# EAGLE schematic chaves (EAGLE 7.2.0)
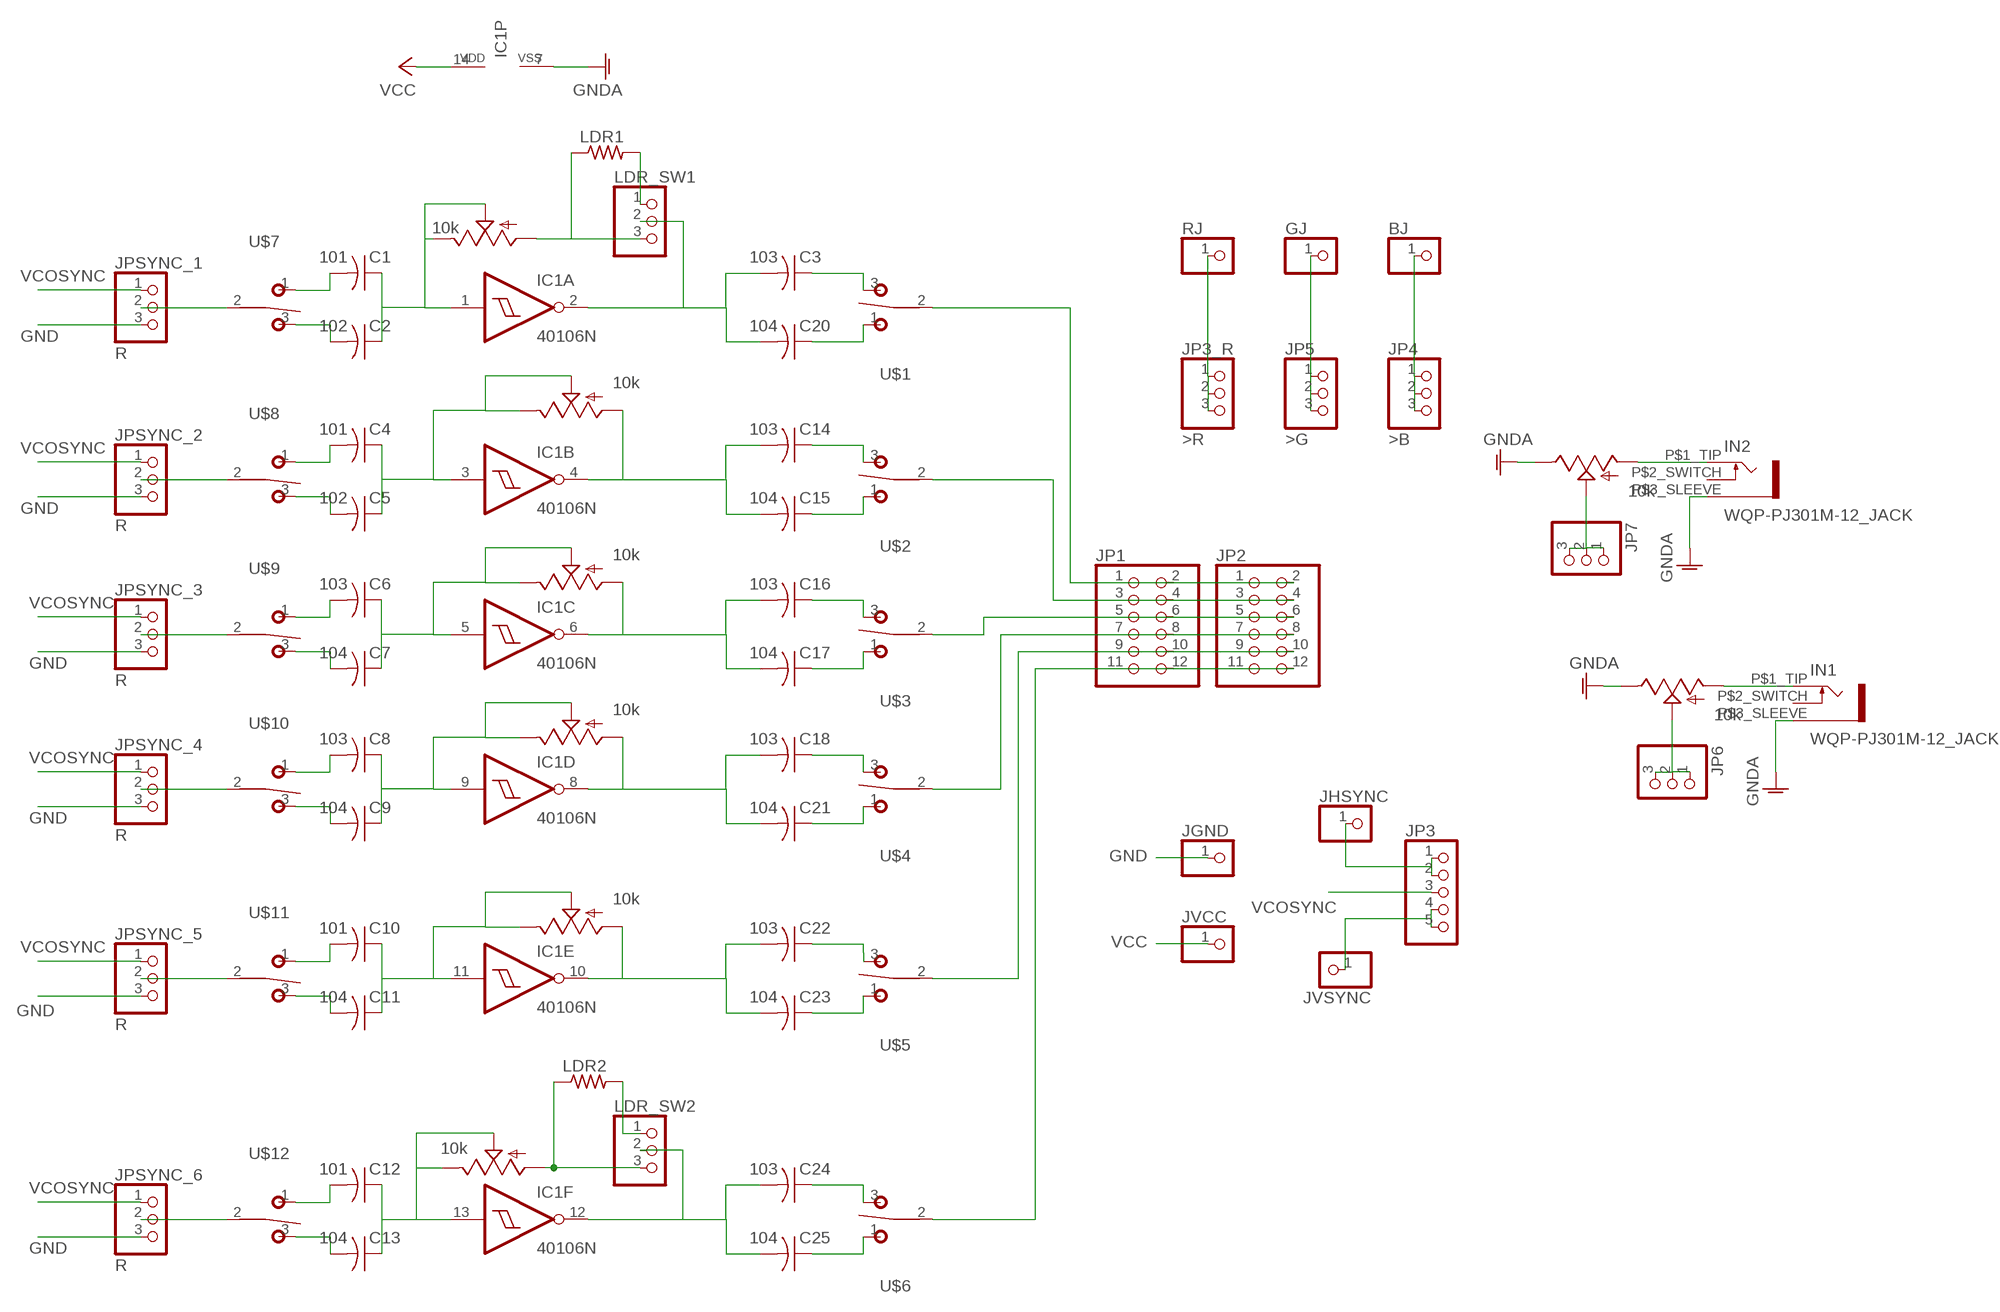
[diagram p0: schematic, sheet 1]

## Parts
BJ  PINHD-1X1  [1X01]
C1  101  C-US050-025X075  [C050-025X075]
C2  102  C-US050-025X075  [C050-025X075]
C3  103  C-US050-025X075  [C050-025X075]
C4  101  C-US050-025X075  [C050-025X075]
C5  102  C-US050-025X075  [C050-025X075]
C6  103  C-US050-025X075  [C050-025X075]
C7  104  C-US050-025X075  [C050-025X075]
C8  103  C-US050-025X075  [C050-025X075]
C9  104  C-US050-025X075  [C050-025X075]
C10  101  C-US050-025X075  [C050-025X075]
C11  104  C-US050-025X075  [C050-025X075]
C12  101  C-US050-025X075  [C050-025X075]
C13  104  C-US050-025X075  [C050-025X075]
C14  103  C-US050-025X075  [C050-025X075]
C15  104  C-US050-025X075  [C050-025X075]
C16  103  C-US050-025X075  [C050-025X075]
C17  104  C-US050-025X075  [C050-025X075]
C18  103  C-US050-025X075  [C050-025X075]
C20  104  C-US050-025X075  [C050-025X075]
C21  104  C-US050-025X075  [C050-025X075]
C22  103  C-US050-025X075  [C050-025X075]
C23  104  C-US050-025X075  [C050-025X075]
C24  103  C-US050-025X075  [C050-025X075]
C25  104  C-US050-025X075  [C050-025X075]
GJ  PINHD-1X1  [1X01]
IC1  40106N  [DIL14]
IN1  WQP-PJ301M-12_JACK  [WQP-PJ301M-12_JACK]
IN2  WQP-PJ301M-12_JACK  [WQP-PJ301M-12_JACK]
JGND  PINHD-1X1  [1X01]
JHSYNC  PINHD-1X1  [1X01]
JP1  PINHD-2X6  [2X06]
JP2  PINHD-2X6  [2X06]
JP3  PINHD-1X5  [1X05]
JP3_R  >R  PINHD-1X3  [1X03]
JP4  >B  PINHD-1X3  [1X03]
JP5  >G  PINHD-1X3  [1X03]
JP6  PINHD-1X3CB  [1X03-CLEANBIG]
JP7  PINHD-1X3CB  [1X03-CLEANBIG]
JPSYNC_1  R  PINHD-1X3  [1X03]
JPSYNC_2  R  PINHD-1X3  [1X03]
JPSYNC_3  R  PINHD-1X3  [1X03]
JPSYNC_4  R  PINHD-1X3  [1X03]
JPSYNC_5  R  PINHD-1X3  [1X03]
JPSYNC_6  R  PINHD-1X3  [1X03]
JVCC  PINHD-1X1  [1X01]
JVSYNC  PINHD-1X1  [1X01]
LDR1  R-US_0204/7  [0204/7]
LDR2  R-US_0204/7  [0204/7]
LDR_SW1  PINHD-1X3  [1X03]
LDR_SW2  PINHD-1X3  [1X03]
POT1  10k  POT_USVERTICAL  [ALPS_POT_VERTICAL]
POT2  10k  POT_USVERTICAL  [ALPS_POT_VERTICAL]
POT3  10k  POT_USVERTICAL  [ALPS_POT_VERTICAL]
POT4  10k  POT_USVERTICAL  [ALPS_POT_VERTICAL]
POT5  10k  POT_USVERTICAL  [ALPS_POT_VERTICAL]
POT6  10k  POT_USVERTICAL  [ALPS_POT_VERTICAL]
POT7  10k  POT_USVERTICAL  [ALPS_POT_VERTICAL]
POT8  10k  POT_USVERTICAL  [ALPS_POT_VERTICAL]
RJ  PINHD-1X1  [1X01]
U$1  T-80-T-SPDT-ON-OFF-ON  [M9040P]
U$2  T-80-T-SPDT-ON-OFF-ON  [M9040P]
U$3  T-80-T-SPDT-ON-OFF-ON  [M9040P]
U$4  T-80-T-SPDT-ON-OFF-ON  [M9040P]
U$5  T-80-T-SPDT-ON-OFF-ON  [M9040P]
U$6  T-80-T-SPDT-ON-OFF-ON  [M9040P]
U$7  T-80-T-SPDT-ON-OFF-ON  [M9040P]
U$8  T-80-T-SPDT-ON-OFF-ON  [M9040P]
U$9  T-80-T-SPDT-ON-OFF-ON  [M9040P]
U$10  T-80-T-SPDT-ON-OFF-ON  [M9040P]
U$11  T-80-T-SPDT-ON-OFF-ON  [M9040P]
U$12  T-80-T-SPDT-ON-OFF-ON  [M9040P]

## Nets
GND: IC1.7(P:VSS) IN1.P$3_SLEEVE IN2.P$3_SLEEVE JGND.1 JPSYNC_1.3 JPSYNC_2.3 JPSYNC_3.3 JPSYNC_4.3 JPSYNC_5.3 JPSYNC_6.3 POT7.P$1(E) POT8.P$1(E) ; supply symbol labelled GNDA
GND1: C3.2 C20.2 IC1.2(A:O) LDR_SW1.2
GND2: C14.2 C15.2 IC1.4(B:O) POT2.P$3(A)
GND3: C16.2 C17.2 IC1.6(C:O) POT3.P$3(A)
GND4: C18.2 C21.2 IC1.8(D:O) POT4.P$3(A)
GND5: C22.2 C23.2 IC1.10(E:O) POT5.P$3(A)
GND6: C24.2 C25.2 IC1.12(F:O) LDR_SW2.2
N$1: C1.2 U$7.1(O)
N$2: C2.2 U$7.3(S)
N$3: LDR2.2 LDR_SW2.1
N$4: C5.2 U$8.3(S)
N$5: C4.2 U$8.1(O)
N$6: LDR1.2 LDR_SW1.1
N$7: C8.2 U$10.1(O)
N$8: C9.2 U$10.3(S)
N$9: IN2.P$1_TIP POT8.P$3(A)
N$10: C6.2 U$9.1(O)
N$11: C7.2 U$9.3(S)
N$12: JP6.1 JP6.2 JP6.3 POT7.P$2(S)
N$13: BJ.1 JP4.1 JP4.2 JP4.3
N$14: GJ.1 JP5.1 JP5.2 JP5.3
N$15: JP3_R.1 JP3_R.2 JP3_R.3 RJ.1
N$16: C20.1 U$1.1(O)
N$17: C3.1 U$1.3(S)
N$18: JP1.1 JP1.2 JP2.1 JP2.2 U$1.2(P)
N$19: LDR1.1 LDR_SW1.3 POT1.P$3(A)
N$20: JHSYNC.1 JP3.1 JP3.2
N$21: JP3.4 JP3.5 JVSYNC.1
N$22: LDR2.1 LDR_SW2.3 POT6.P$3(A)
N$23: IN1.P$1_TIP POT7.P$3(A)
N$24: C15.1 U$2.1(O)
N$25: JP7.1 JP7.2 JP7.3 POT8.P$2(S)
N$26: C14.1 U$2.3(S)
N$27: JP1.3 JP1.4 JP2.3 JP2.4 U$2.2(P)
N$28: C17.1 U$3.1(O)
N$29: C16.1 U$3.3(S)
N$30: JP1.5 JP1.6 JP2.5 JP2.6 U$3.2(P)
N$31: C1.1 C2.1 IC1.1(A:I) POT1.P$1(E) POT1.P$2(S)
N$32: C4.1 C5.1 IC1.3(B:I) POT2.P$1(E) POT2.P$2(S)
N$33: C6.1 C7.1 IC1.5(C:I) POT3.P$1(E) POT3.P$2(S)
N$34: C8.1 C9.1 IC1.9(D:I) POT4.P$1(E) POT4.P$2(S)
N$37: C21.1 U$4.1(O)
N$38: C18.1 U$4.3(S)
N$39: JP1.7 JP1.8 JP2.7 JP2.8 U$4.2(P)
N$40: C23.1 U$5.1(O)
N$41: C22.1 U$5.3(S)
N$42: JP1.9 JP1.10 JP2.9 JP2.10 U$5.2(P)
N$43: C25.1 U$6.1(O)
N$44: C24.1 U$6.3(S)
N$45: JP1.11 JP1.12 JP2.11 JP2.12 U$6.2(P)
N$46: C10.2 U$11.1(O)
N$47: C10.1 C11.1 IC1.11(E:I) POT5.P$1(E) POT5.P$2(S)
N$48: C11.2 U$11.3(S)
N$49: C13.2 U$12.3(S)
N$50: C12.2 U$12.1(O)
N$51: C12.1 C13.1 IC1.13(F:I) POT6.P$1(E) POT6.P$2(S)
SS1: JPSYNC_1.2 U$7.2(P)
SS2: JPSYNC_2.2 U$8.2(P)
SS3: JPSYNC_3.2 U$9.2(P)
SS4: JPSYNC_4.2 U$10.2(P)
SS5: JPSYNC_5.2 U$11.2(P)
SS6: JPSYNC_6.2 U$12.2(P)
VCC: IC1.14(P:VDD) JVCC.1
VCOSYNC: JP3.3 JPSYNC_1.1 JPSYNC_2.1 JPSYNC_3.1 JPSYNC_4.1 JPSYNC_5.1 JPSYNC_6.1
Unconnected: IN1.P$2_SWITCH IN2.P$2_SWITCH

## Library data of the parts
BJ GJ JGND JHSYNC JVCC JVSYNC RJ = adafruit:PINHD-1X1: Pin header 1x1 for 0.1" spacing With round pins
C1-C18 C20-C25 = adafruit:C-US: CAPACITOR, American symbol
IC1 = 40xx:40106: Hex SCHMITT TRIGGER
IN1 IN2 = MusicThingModular:WQP-PJ301M-12_JACK
JP1 JP2 = pinhead:PINHD-2X6: PIN HEADER
JP3 = pinhead:PINHD-1X5: PIN HEADER
JP3_R JP4 JP5 JPSYNC_1-JPSYNC_6 LDR_SW1 LDR_SW2 = pinhead:PINHD-1X3: PIN HEADER
JP6 JP7 = adafruit:PINHD-1X3: PIN HEADER
LDR1 LDR2 = adafruit:R-US_: RESISTOR, American symbol
POT1-POT8 = pot-alps:POT_US
U$1-U$12 = MusicThingModular:T-80-T-SPDT-ON-OFF-ON

## Net classes
0 default: width 0.406 mm, drill 0.254 mm, clearance 0.254 mm